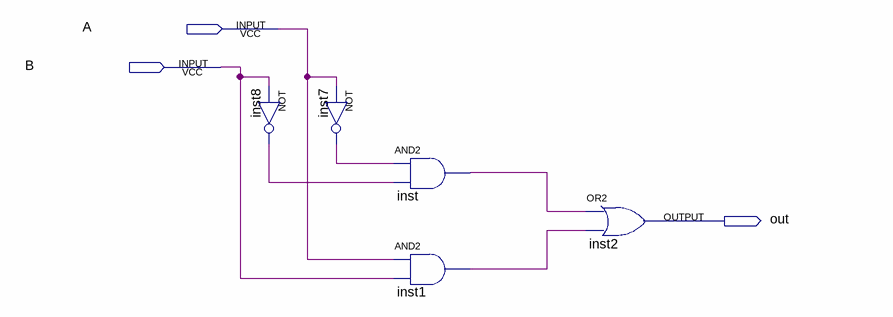
[diagram p0: schematic sheet]
// Quartus schematic IgualBit.bdf as structural Verilog: 5 symbols, 3 pins
module IgualBit (
  input  A,
  input  B,
  output out
);

  wire inst1_out, inst7_out, inst8_out, inst_out;

  not inst8 (inst8_out, B);
  not inst7 (inst7_out, A);
  and inst (inst_out, inst7_out, inst8_out);
  and inst1 (inst1_out, A, B);
  or inst2 (out, inst_out, inst1_out);
endmodule
